# EasyEDA schematic 涂鸦拓展板_2021-06-02.json
TITLE: Sheet_1; REV: 1.0; Date: 2021-06-02; Sheet: 1/1; Drawn By: szongen; Company: Your Company
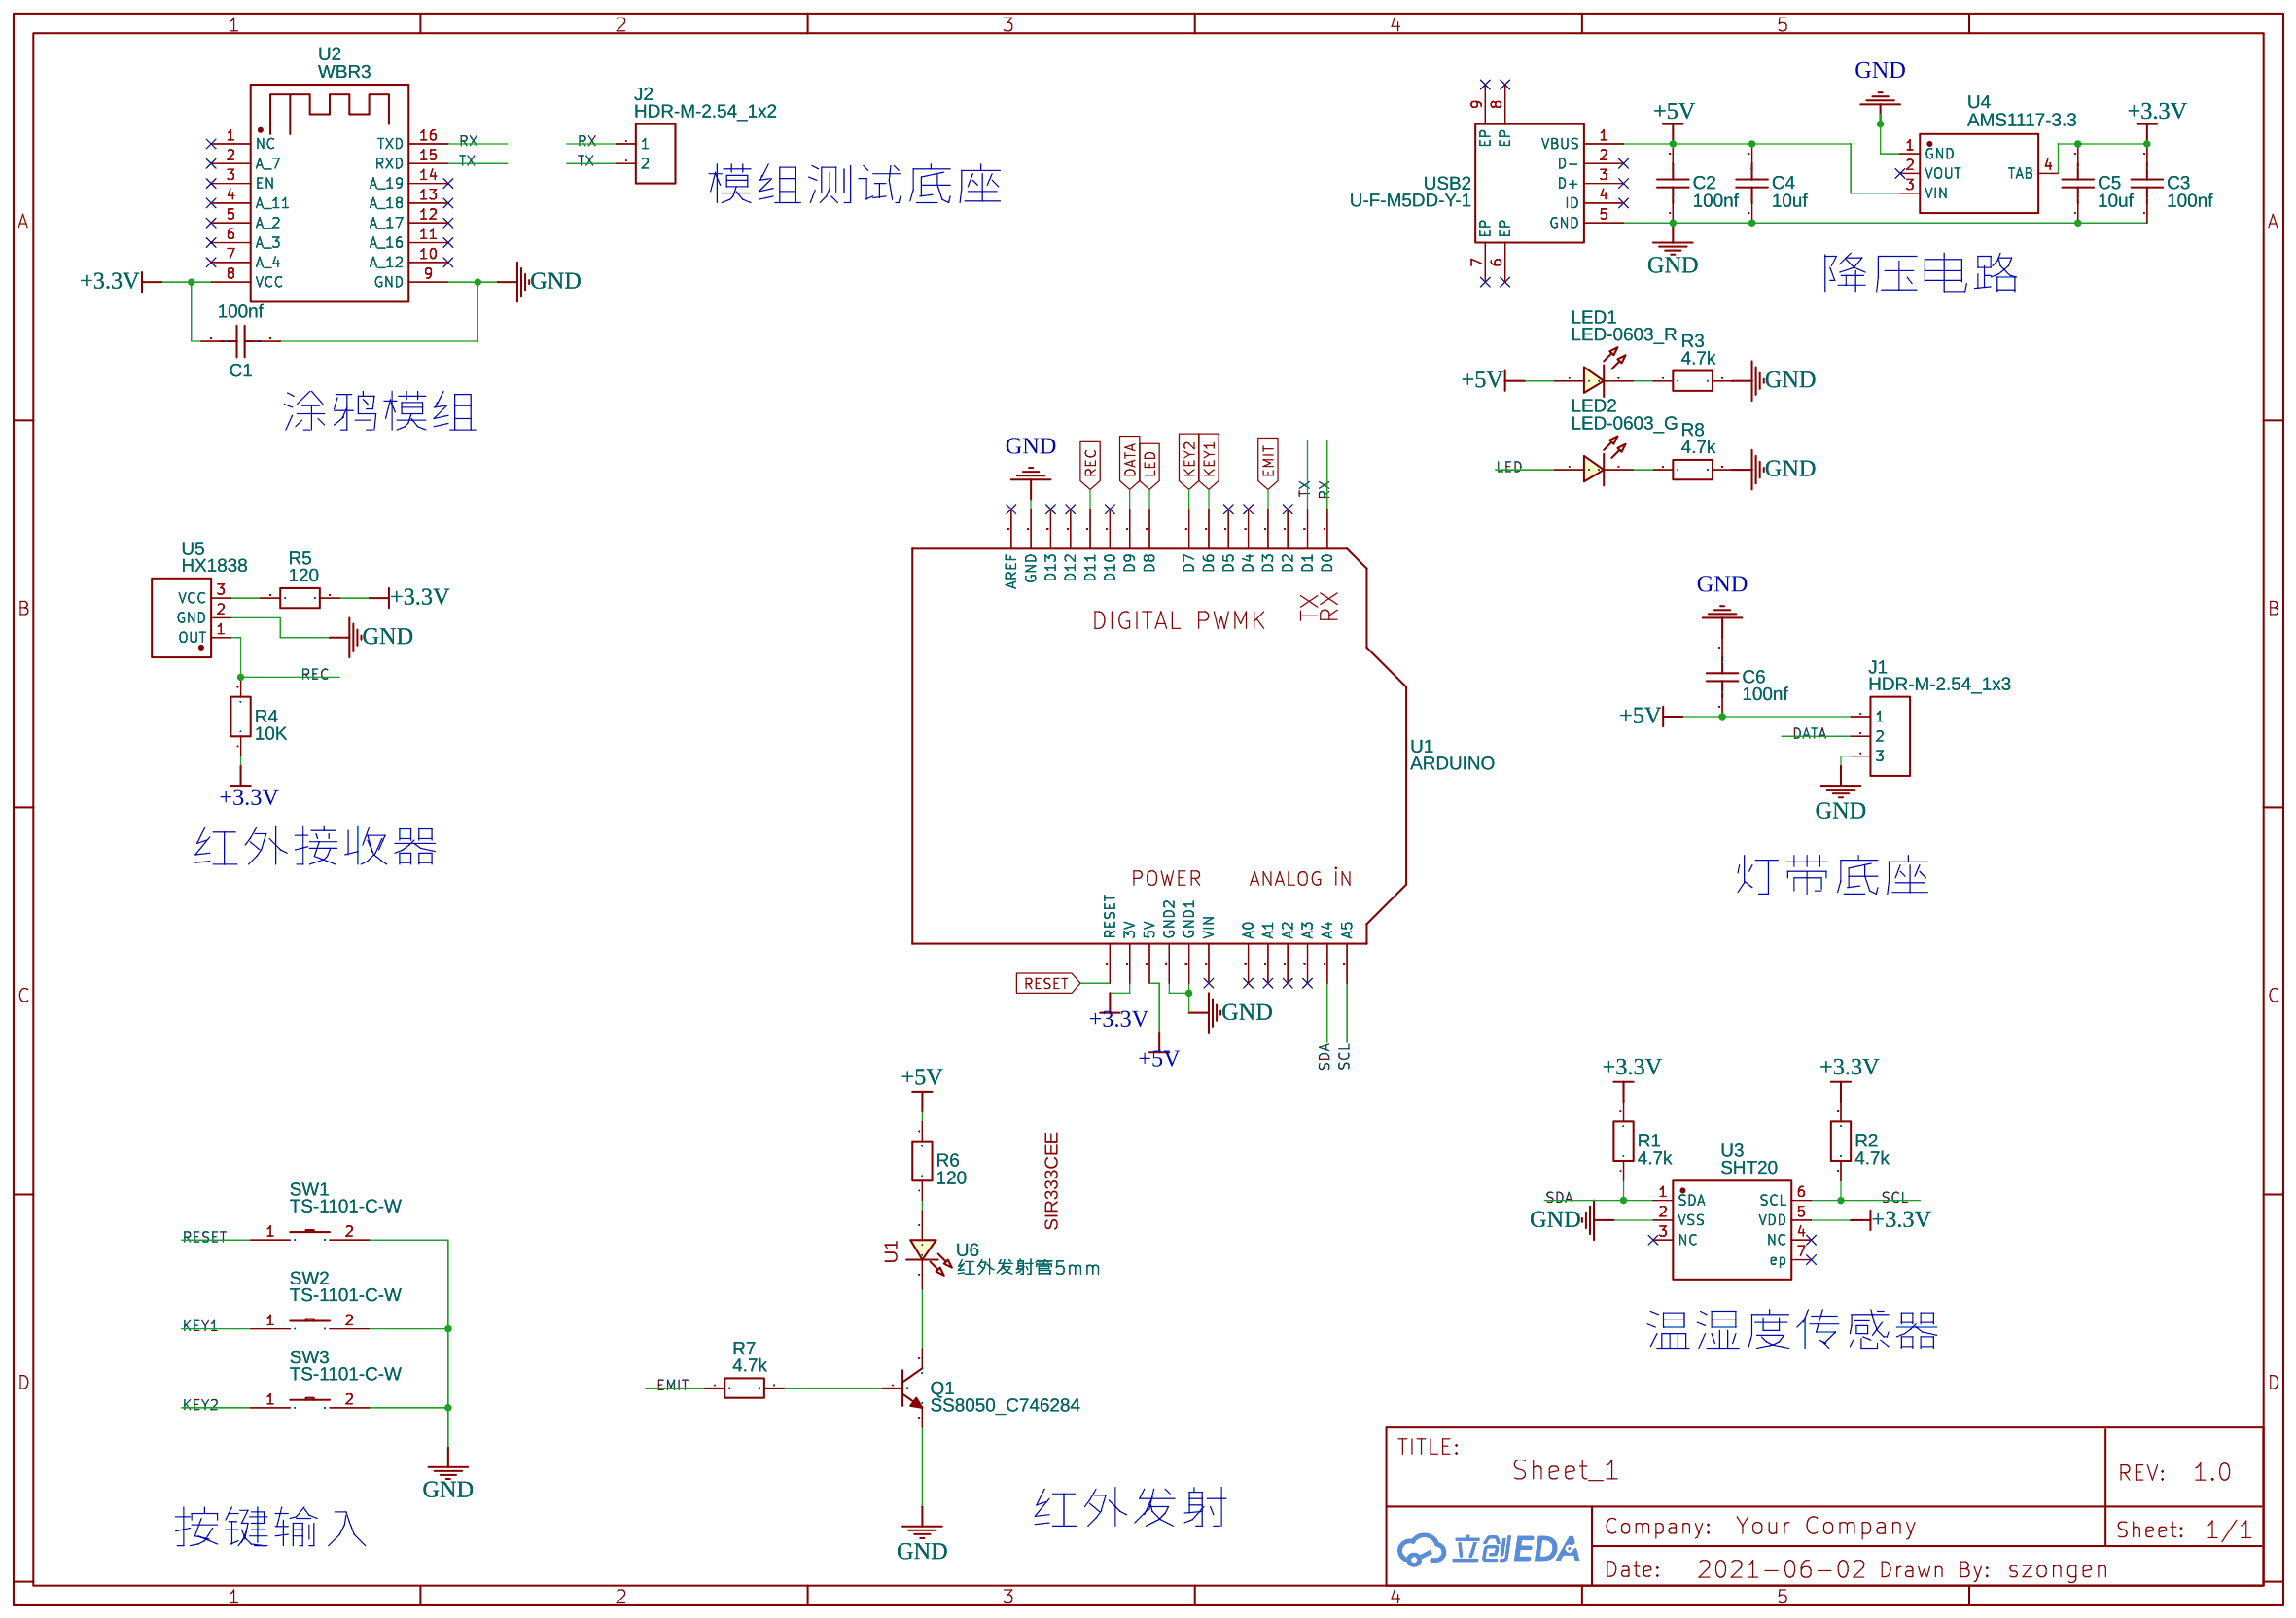
[diagram p0: schematic sheet]

## Parts
C1  100nf  [C0603]
C2  100nf  [C0603]
C3  100nf  [C0603]
C4  10uf  [C0603]
C5  10uf  [C0603]
C6  100nf  [C0603]
J1  HDR-M-2.54_1x3  [HDR-M-2.54_1X3]
J2  HDR-M-2.54_1x2  [HDR-M-2.54_1X2]
LED1  LED-0603_R  [LED0603_RED]
LED2  LED-0603_G  [LED0603_GREEN]
Q1  SS8050_C746284  [SOT-23-3_L2.9-W1.3-P1.90-LS2.4-BR]
R1  4.7k  [R0603]
R2  4.7k  [R0603]
R3  4.7k  [R0603]
R4  10K  [R0805]
R5  120  [R0805]
R6  120  [R0805]
R7  4.7k  [R0805]
R8  4.7k  [R0603]
SW1  TS-1101-C-W  [SW-SMD_L6.0-W3.3-LS8.0]
SW2  TS-1101-C-W  [SW-SMD_L6.0-W3.3-LS8.0]
SW3  TS-1101-C-W  [SW-SMD_L6.0-W3.3-LS8.0]
U1  ARDUINO  [ARDUINO]
U2  WBR3  [WBR3]
U3  SHT20  [DFN-6_L3.0-W3.0-P0.95-TR-EP]
U4  AMS1117-3.3  [SOT-223-3_L6.5-W3.4-P2.30-LS7.0-BR]
U5  HX1838  [HX1838]
U6  红外发射管5mm  [123]
USB2  U-F-M5DD-Y-1  [MICRO-USB-SMD_U-F-M5DD-Y-1]

## Library data of the parts
C1-C6 = C_0603_US: Contributor: LCEDA_Lib
J1 = HDR-M-2.54_1x3: Supplier Part: C180248; Supplier: LCSC; Contributor: LCEDA_Lib
J2 = HDR-M-2.54_1x2: Supplier Part: C124375; Supplier: LCSC; Contributor: LCEDA_Lib
LED1 = LED-0603_R: Manufacturer: EVERLIGHT(台湾亿光); Manufacturer Part: 19-217/R6C-AL1M2VY/3T; Supplier Part: C72044; Supplier: LCSC; Contributor: LCEDA_01
LED2 = LED-0603_G: Manufacturer: EVERLIGHT(台湾亿光); Manufacturer Part: 19-217/GHC-YR1S2/3T; Supplier Part: C72043; Supplier: LCSC; Contributor: LCEDA_Lib
Q1 = SS8050_C746284: Supplier: LCSC; Supplier Part: C746284; Manufacturer: HT(Shenzhen Jinyu Semicon); Manufacturer Part: SS8050; Contributor: LCSC
R1-R3 R8 = R_0603_EU: Contributor: LCEDA_Lib
R4-R7 = R_0805_EU: Contributor: LCEDA_Lib
SW1-SW3 = TS-1101-C-W: Supplier: LCSC; Supplier Part: C318938; Manufacturer: XKB Connectivity(中国星坤); Contributor: LCSC; JLCPCB Part Class: Extended Part
U1 = ARDUINO: Contributor: Adafruit; sourceId: qM4YgyQKE
U2 = WBR3: Contributor: 退役熬夜选手
U3 = SHT20: Supplier: LCSC; Manufacturer: Sensirion; Supplier Part: C53865; JLCPCB Part Class: Extended Part
U4 = AMS1117-3.3_C351784: Supplier: LCSC; Supplier Part: C351784; Manufacturer: PUOLOP; Contributor: LCSC; JLCPCB Part Class: Extended Part
U5 = HX1838: Manufacturer Part: 0; link: https://item.taobao.com/item.htm?spm=a1z09.2.0.0.1ea22e8d48OTx3&id=522552967131&_u=1esjrio323d; Contributor: EDAUSER001
U6 = 红外发射管5mm: Contributor: yidiandian
USB2 = U-F-M5DD-Y-1: Supplier: LCSC; Manufacturer: HRO; Supplier Part: C91467; JLCPCB Part Class: Extended Part

## Nets
+3.3V: C1.1 C3.2 C5.2 R1.2 R2.2 R4.1 R5.2 U1.3V U2.8(VCC) U3.5(VDD) U4.4(TAB)
+5V: C2.2 C4.2 C6.1 J1.1 LED1.1 R6.2 U1.5V U4.3(VIN) USB2.1(VBUS)
GND: C1.2 C2.1 C3.1 C4.1 C5.1 C6.2 J1.3 Q1.2(E) R3.2 R8.2 SW1.2 SW2.2 SW3.2 U1.GND U1.GND1 U1.GND2 U2.9(GND) U3.2(VSS) U4.1(GND) U5.2(GND) USB2.5(GND)
DATA: J1.2 U1.D9
EMIT: R7.1 U1.D3
KEY1: SW2.1 U1.D6
KEY2: SW3.1 U1.D7
LED: LED2.1 U1.D8
REC: R4.2 U1.D11 U5.1(OUT)
RESET: SW1.1 U1.RESET
RX: J2.1 U1.D0 U2.16(TXD)
SCL: R2.1 U1.A5 U3.6(SCL)
SDA: R1.1 U1.A4 U3.1(SDA)
TX: J2.2 U1.D1 U2.15(RXD)
Net-(LED1-2): LED1.2 R3.1
Net-(LED2-2): LED2.2 R8.1
Net-(Q1-1): Q1.1(B) R7.2
Net-(Q1-3): Q1.3(C) U6.2(C)
Net-(R5-1): R5.1 U5.3(VCC)
Net-(R6-1): R6.1 U6.1(A)

Not connected (* = marked no-connect by the designer): U1 A0* A1* A2* A3* AREF* D2* D4* D5* D10* D12* D13* VIN*; U2 1(NC)* 2(A_7)* 3(EN)* 4(A_11)* 5(A_2)* 6(A_3)* 7(A_4)* 10(A_12)* 11(A_16)* 12(A_17)* 13(A_18)* 14(A_19)*; U3 3(NC)* 4(NC)* 7(ep)*; U4 2(VOUT)*; USB2 2(D-)* 3(D+)* 4(ID)* 6(EP)* 7(EP)* 8(EP)* 9(EP)*

## Notes on the sheet
- 模组测试底座
- 降压电路
- 涂鸦模组
- 红外接收器
- 灯带底座
- 温湿度传感器
- 红外发射
- 按键输入
